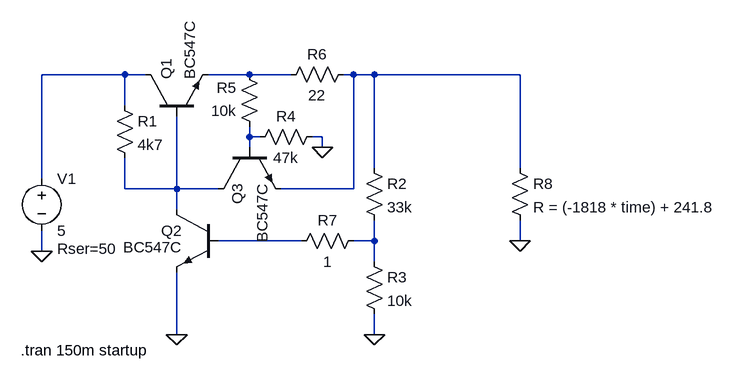
[diagram p0: schematic PS_BME680.asc]
PS_BME680.asc, the LTspice schematic file:
Version 4
SHEET 1 948 680
WIRE 0 -32 -128 -32
WIRE 32 -32 0 -32
WIRE 192 -32 128 -32
WIRE 256 -32 192 -32
WIRE 352 -32 336 -32
WIRE 384 -32 352 -32
WIRE 608 -32 384 -32
WIRE 0 16 0 -32
WIRE 192 64 192 48
WIRE 208 64 192 64
WIRE 304 64 288 64
WIRE 192 80 192 64
WIRE 304 80 304 64
WIRE 384 112 384 -32
WIRE 608 112 608 -32
WIRE -128 128 -128 -32
WIRE 0 144 0 96
WIRE 80 144 80 32
WIRE 80 144 0 144
WIRE 144 144 80 144
WIRE 352 144 352 -32
WIRE 352 144 240 144
WIRE 80 176 80 144
WIRE 272 224 144 224
WIRE 384 224 384 192
WIRE 384 224 352 224
WIRE 608 224 608 192
WIRE -128 240 -128 208
WIRE 384 256 384 224
WIRE 80 368 80 272
WIRE 384 368 384 336
FLAG 304 80 0
FLAG 384 368 0
FLAG 80 368 0
FLAG -128 240 0
FLAG 608 224 0
SYMBOL npn 32 32 R270
SYMATTR InstName Q1
SYMATTR Value BC547C
SYMBOL npn 144 176 M0
WINDOW 3 56 58 Left 2
SYMATTR Value BC547C
SYMATTR InstName Q2
SYMBOL npn 144 80 M90
WINDOW 0 56 29 Left 2
SYMATTR InstName Q3
SYMATTR Value BC547C
SYMBOL res -16 0 R0
SYMATTR InstName R1
SYMATTR Value 4k7
SYMBOL res 368 96 R0
SYMATTR InstName R2
SYMATTR Value 33k
SYMBOL res 368 240 R0
SYMATTR InstName R3
SYMATTR Value 10k
SYMBOL res 304 48 R90
WINDOW 0 0 56 VBottom 2
WINDOW 3 32 56 VTop 2
SYMATTR InstName R4
SYMATTR Value 47k
SYMBOL res 208 64 R180
WINDOW 0 36 76 Left 2
WINDOW 3 36 40 Left 2
SYMATTR InstName R5
SYMATTR Value 10k
SYMBOL res 352 -48 R90
WINDOW 0 0 56 VBottom 2
WINDOW 3 32 56 VTop 2
SYMATTR InstName R6
SYMATTR Value 22
SYMBOL voltage -128 112 R0
WINDOW 123 0 0 Left 0
WINDOW 39 24 124 Left 2
SYMATTR SpiceLine Rser=50
SYMATTR InstName V1
SYMATTR Value 5
SYMBOL res 368 208 R90
WINDOW 0 0 56 VBottom 2
WINDOW 3 32 56 VTop 2
SYMATTR InstName R7
SYMATTR Value 1
SYMBOL res 592 96 R0
SYMATTR InstName R8
SYMATTR Value R = (-1818 * time) + 241.8
TEXT -160 392 Left 2 !.tran 150m startup

The netlist it stands for:
* PS_BME680.asc
Q1 N001 N005 N002 0 BC547C
Q2 N005 N006 0 0 BC547C
Q3 N005 N004 N003 0 BC547C
R1 N001 N005 4k7
R2 N003 N007 33k
R3 N007 0 10k
R4 0 N004 47k
R5 N004 N002 10k
R6 N003 N002 22
V1 N001 0 5 Rser=50
R7 N007 N006 1
R8 N003 0 R = (-1818 * time) + 241.8
.model NPN NPN
.model PNP PNP
.lib standard.bjt
.tran 150m startup
.backanno
.end